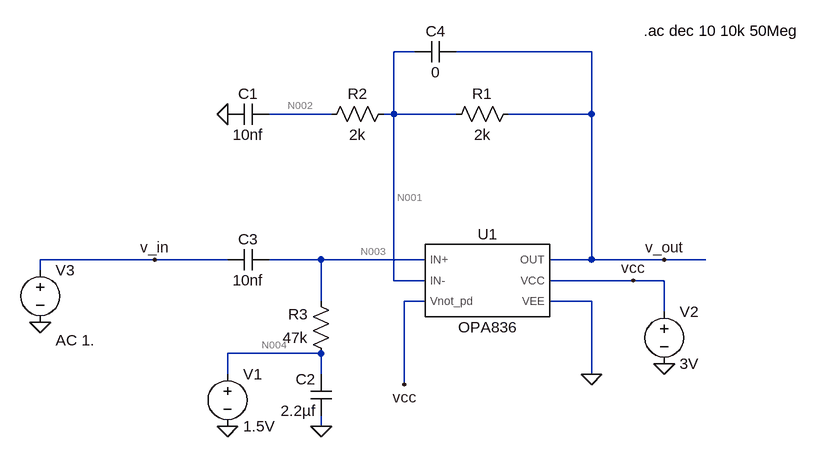
[diagram p0: schematic preamp.asc]
preamp.asc, the LTspice schematic file:
Version 4
SHEET 1 888 680
WIRE 96 -160 64 -160
WIRE 368 -160 160 -160
WIRE -32 -64 -128 -64
WIRE 64 -64 64 -160
WIRE 64 -64 48 -64
WIRE 160 -64 64 -64
WIRE 368 -64 368 -160
WIRE 368 -64 240 -64
WIRE -304 160 -480 160
WIRE -192 160 -304 160
WIRE -48 160 -128 160
WIRE 112 160 -48 160
WIRE 368 160 368 -64
WIRE 368 160 304 160
WIRE 480 160 368 160
WIRE 544 160 480 160
WIRE -480 176 -480 160
WIRE 64 192 64 -64
WIRE 112 192 64 192
WIRE 432 192 304 192
WIRE 480 192 432 192
WIRE -48 224 -48 160
WIRE 112 224 80 224
WIRE 368 224 304 224
WIRE 480 240 480 192
WIRE -48 304 -192 304
WIRE -192 336 -192 304
WIRE -48 336 -48 304
WIRE 368 336 368 224
WIRE 80 352 80 224
WIRE -48 416 -48 400
FLAG 480 320 0
FLAG 368 336 0
FLAG -192 416 0
FLAG 480 160 v_out
FLAG -192 -64 0
FLAG -48 416 0
FLAG 432 192 vcc
FLAG 80 352 vcc
FLAG -304 160 v_in
FLAG -480 256 0
SYMBOL res 256 -80 R90
WINDOW 0 0 56 VBottom 2
WINDOW 3 32 56 VTop 2
SYMATTR InstName R1
SYMATTR Value 2k
SYMBOL res 64 -80 R90
WINDOW 0 0 56 VBottom 2
WINDOW 3 32 56 VTop 2
SYMATTR InstName R2
SYMATTR Value 2k
SYMBOL res -32 320 R180
WINDOW 0 36 76 Left 2
WINDOW 3 36 40 Left 2
SYMATTR InstName R3
SYMATTR Value 47k
SYMBOL voltage -192 320 R0
WINDOW 123 0 0 Left 0
WINDOW 39 0 0 Left 0
SYMATTR InstName V1
SYMATTR Value 1.5V
SYMBOL voltage 480 224 R0
WINDOW 123 0 0 Left 0
WINDOW 39 0 0 Left 0
SYMATTR InstName V2
SYMATTR Value 3V
SYMBOL cap -128 -80 R90
WINDOW 0 0 32 VBottom 2
WINDOW 3 32 32 VTop 2
SYMATTR InstName C1
SYMATTR Value 10nf
SYMBOL cap -32 400 R180
WINDOW 0 24 56 Left 2
WINDOW 3 24 8 Left 2
SYMATTR InstName C2
SYMATTR Value 2.2µf
SYMBOL cap -192 176 R270
WINDOW 0 32 32 VTop 2
WINDOW 3 0 32 VBottom 2
SYMATTR InstName C3
SYMATTR Value 10nf
SYMBOL voltage -480 160 R0
WINDOW 123 24 124 Left 2
WINDOW 39 0 0 Left 0
SYMATTR Value2 AC 1.
SYMATTR InstName V3
SYMATTR Value ""
SYMBOL OPA836 208 192 R0
SYMATTR InstName U1
SYMBOL cap 160 -176 R90
WINDOW 0 0 32 VBottom 2
WINDOW 3 32 32 VTop 2
SYMATTR InstName C4
SYMATTR Value 0
TEXT 448 -192 Left 2 !.ac dec 10 10k 50Meg

The netlist it stands for:
* preamp.asc
R1 v_out N001 2k
R2 N001 N002 2k
R3 N004 N003 47k
V1 N004 0 1.5V
V2 vcc 0 3V
C1 N002 0 10nf
C2 0 N004 2.2µf
C3 v_in N003 10nf
V3 v_in 0 AC 1.
XU1 N003 N001 v_out vcc 0 vcc OPA836  ; pins IN+ IN- OUT VCC VEE Vnot_pd
C4 v_out N001 0
.ac dec 10 10k 50Meg
.lib C:\Users\serge\Documents\repos\wulpus_pro\ltspice_sim\wulpus_pro_rx\opa836_a.lib
.backanno
.end

* Results of the author's LTspice run, read from the files saved beside the schematic
* Operating Point, zero values left out:
*   V(v_out) = 1.476 V
*   V(n001) = 1.475 V
*   V(n002) = 1.475 V
*   V(n004) = 1.5 V
*   V(n003) = 1.475 V
*   V(vcc) = 3 V
*   I(R1) = 496.9 nA
*   I(R3) = 526.1 nA
*   I(V1) = -526.1 nA
*   I(V2) = -1.004 mA
*   Ix(u1:IN+) = 526.1 nA
*   Ix(u1:IN-) = 496.9 nA
*   Ix(u1:OUT) = -496.9 nA
*   Ix(u1:VCC) = 1.004 mA
*   Ix(u1:VEE) = -1.004 mA
*   Ix(u1:VNOT_PD) = 23 nA
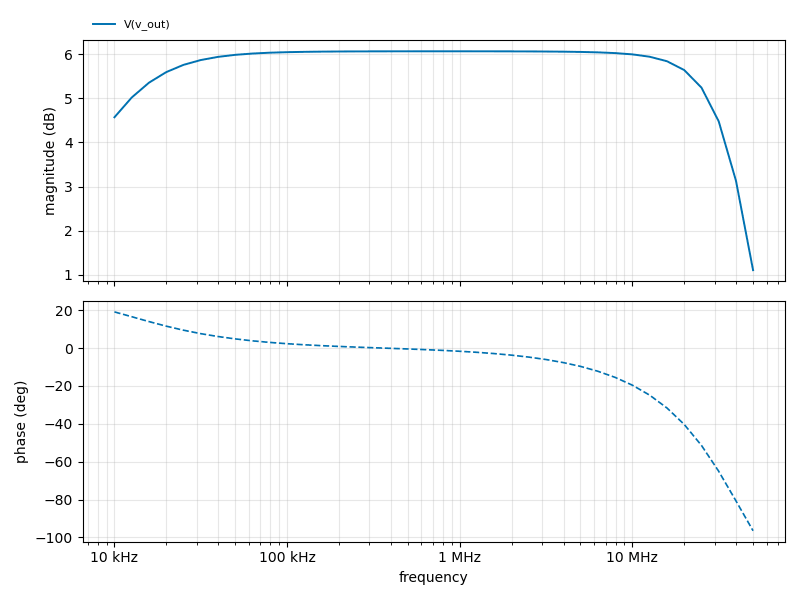
[diagram p1: AC Analysis of preamp.asc, plotted from the saved traces]
* AC Analysis, 1 run:
*   V(v_out): 4.57 dB at 10 kHz, 1.11 dB at 50 MHz, peak 6.06 dB at 794.3 kHz, 3 dB below the peak at 40.16 MHz